# Altium schematic sheet EEPROM.SchDoc
size A4; SheetNumber: 4
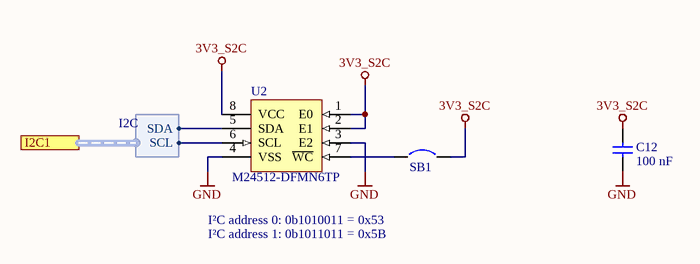
[diagram p0: EEPROM.SchDoc]

## Parts
C12  100 nF  [C_0603_TE]
SB1  Solder Bump 0603  [SB_0603]  (value not drawn)  (no BOM)
U2  M24512-DFMN6TP  [D0008A_N]

## Ports
I2C1 (harness I2C)

## Harnesses
I2C: SCL, SDA

## Nets
3V3_S2C: C12.1 SB1.2 U2.1(E0) U2.2(E1) U2.8(VCC)
GND: C12.2 U2.3(E2) U2.4(VSS)
NetSB1_1: SB1.1 U2.7(~{WC})
NetU2_5: U2.5(SDA) ; port I2C1.SDA
NetU2_6: U2.6(SCL) ; port I2C1.SCL

## Notes on the sheet
- I²C address 0: 0b1010011 = 0x53
- I²C address 1: 0b1011011 = 0x5B
- Title
- Revision:
- Design Engineer:
- Date:
- Project:
- Sheet
- of

## Library data of the parts
C12 = UZgen_C_0603_100nF_50V_X7R: Generic capacitor; Manufacturer: UZgen; Tolerance: 10 %; Voltage: 50V; Created from: AGeiger; Technology: X7R; Value: 100 nF; Manufacturer Part Number: UZgen_C_0603_100nF_50V_X7R; PartID: 1; Created On: 02/07/2024 14:42:23; Device Package: 0603; Mounting Type: SMD; Last Updated: 08/08/2024 15:01:15
SB1 = =Value: Created from: AGeiger; Revision: July-2002: Re-released for DXP Platform.; Manufacturer Part Number: Solder Bump 0603; PartID: 1; Created On: 09/01/2024 17:13:56; Component Type: Solder Bump; Device Package: 0603; Last Updated: 09/01/2024 17:13:56; Mounting Type: SMD; Value: Solder Bump 0603
U2 = M24512-DFMN6TP: 512Kbit 1MHz I2C SOP-8 EEPROM ROHS; Manufacturer: STMicroelectronics; Created from: FRosner; Manufacturer Part Number: M24512-DFMN6TP; PartID: 6; Created On: 07/09/2024 12:11:36; ComponentLink1Description: Datasheet; ComponentLink1URL: https://wmsc.lcsc.com/wmsc/upload/file/pdf/v2/lcsc/2304140030_STMicroelectronics-M24512-DFMN6TP_C222090.pdf; Component Type: EEPROM; Device Package: SOP-8; Last Updated: 07/09/2024 12:18:21; Mounting Type: SMD; Operating Temperature: -40 to +85 °C; Series: M24xxx; Supplier 1: Mouser; Supplier Part Number 1: 511-M24512-DFMN6TP; Supplier 2: LCSC; Supplier Part Number 2: C222090; Type: Memory; Value: M24512-DFMN6TP; LCSC Part Number: C222090